# EAGLE board AMS Segment rev18 (EAGLE 9.6.2), part 1 of 2
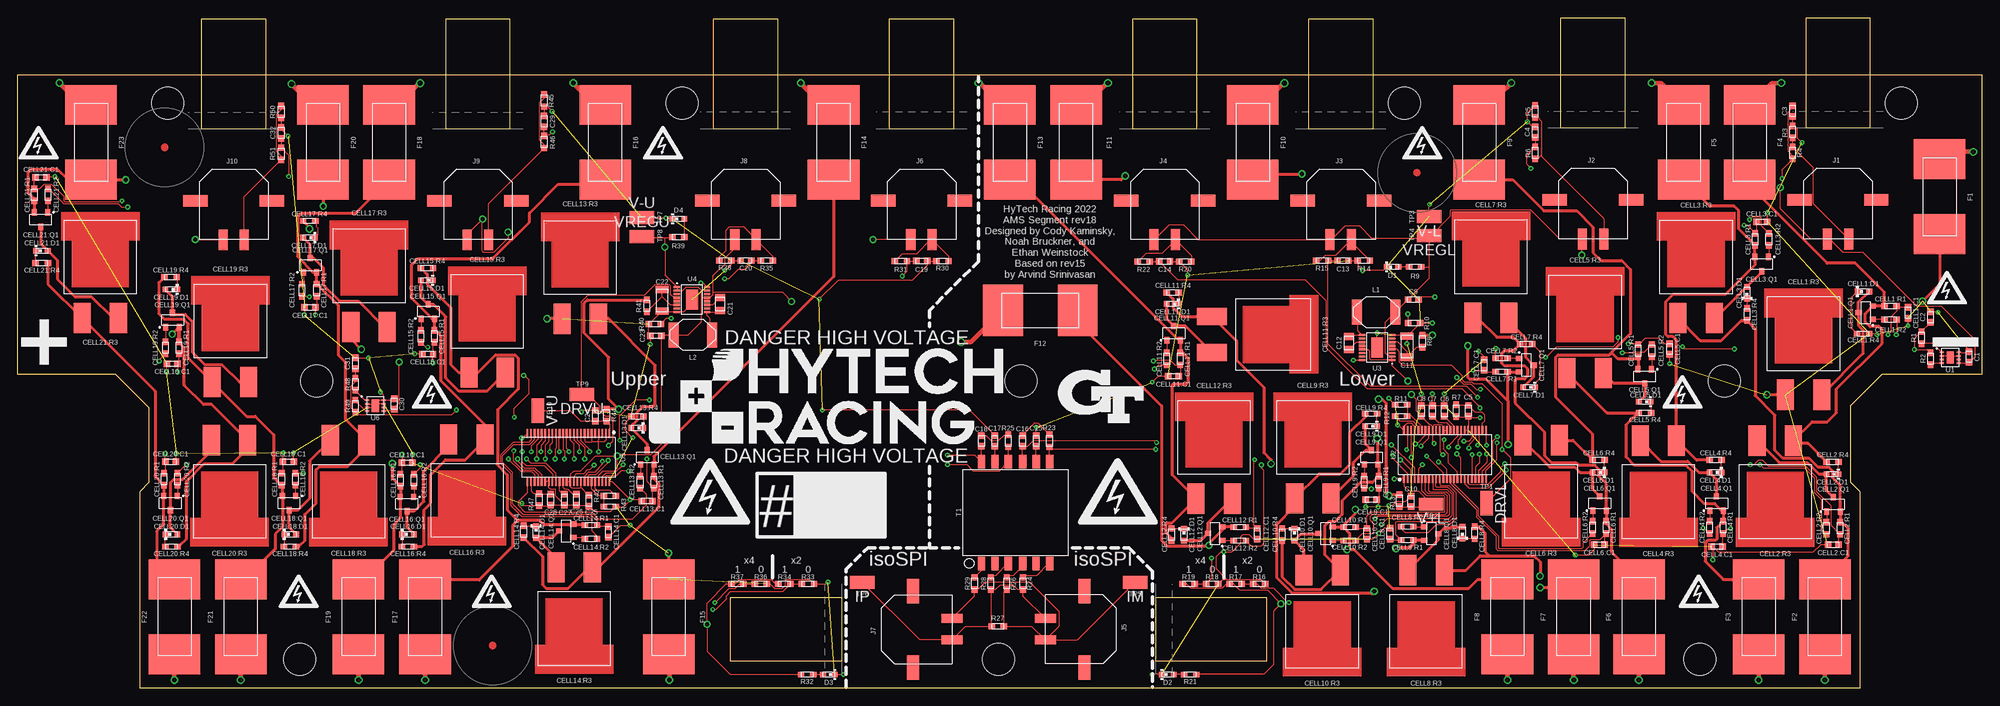
[diagram p3: board, top side]
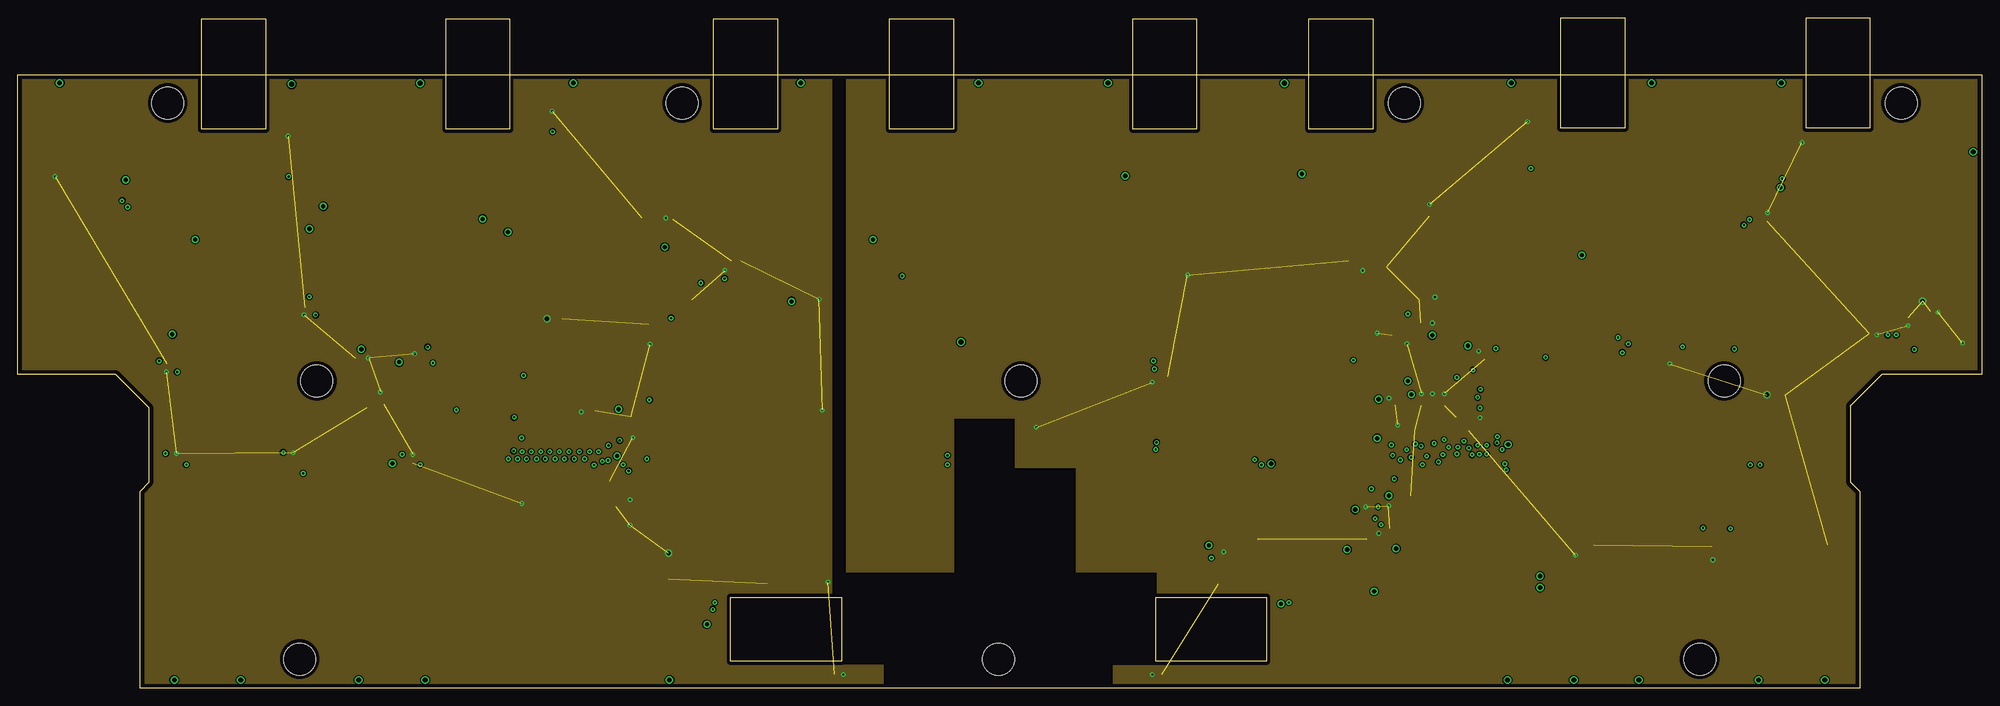
[diagram p4: board, inner layer Route2]
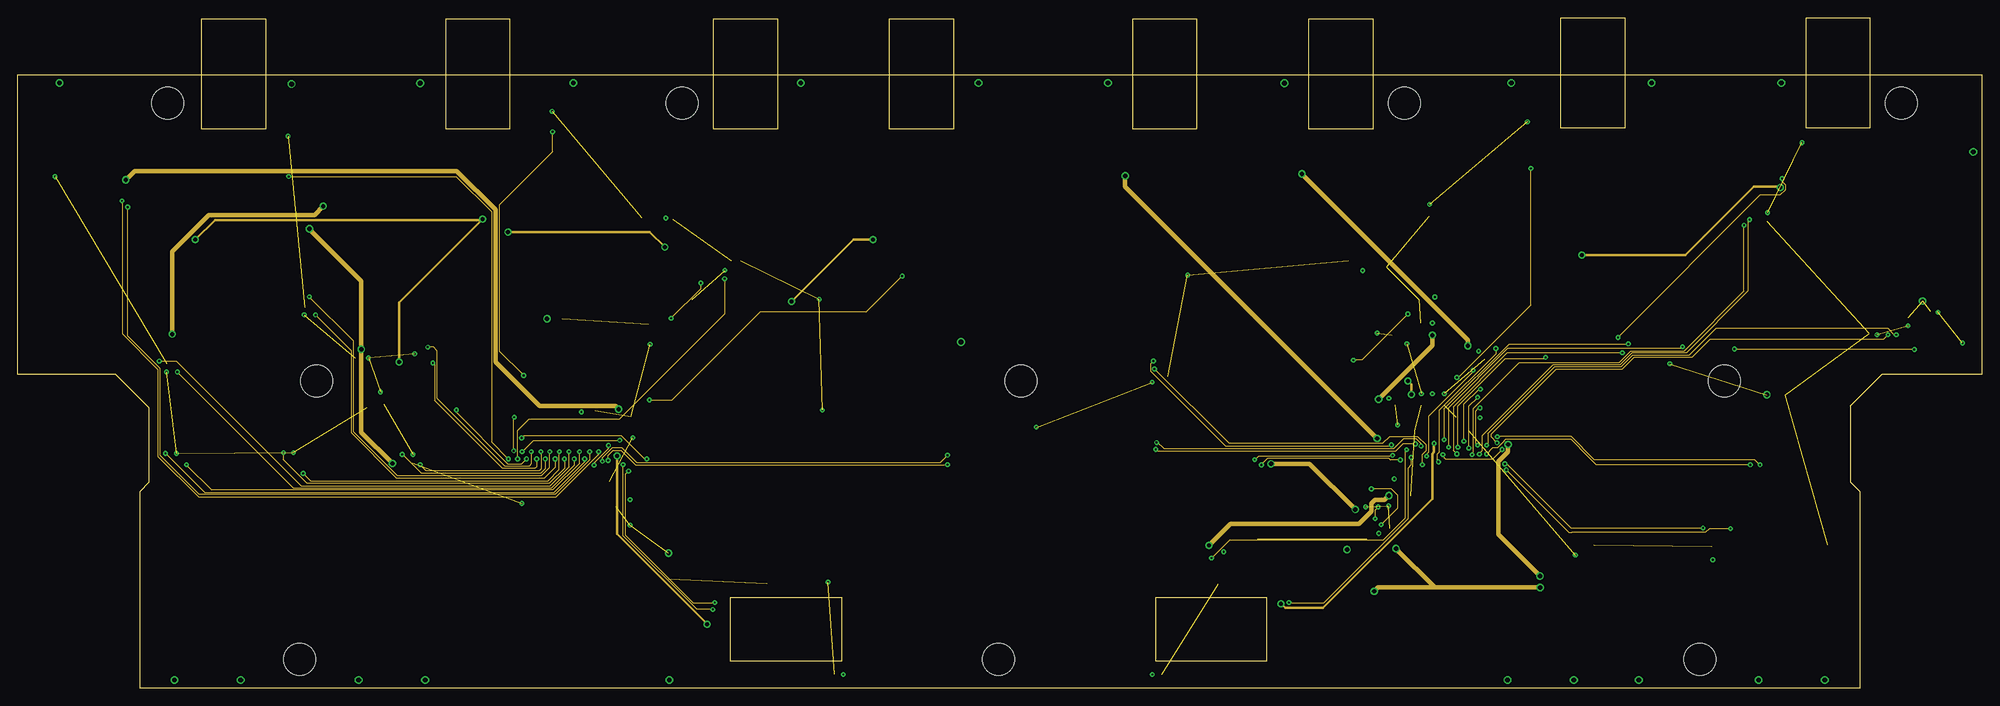
[diagram p5: board, inner layer Route15]
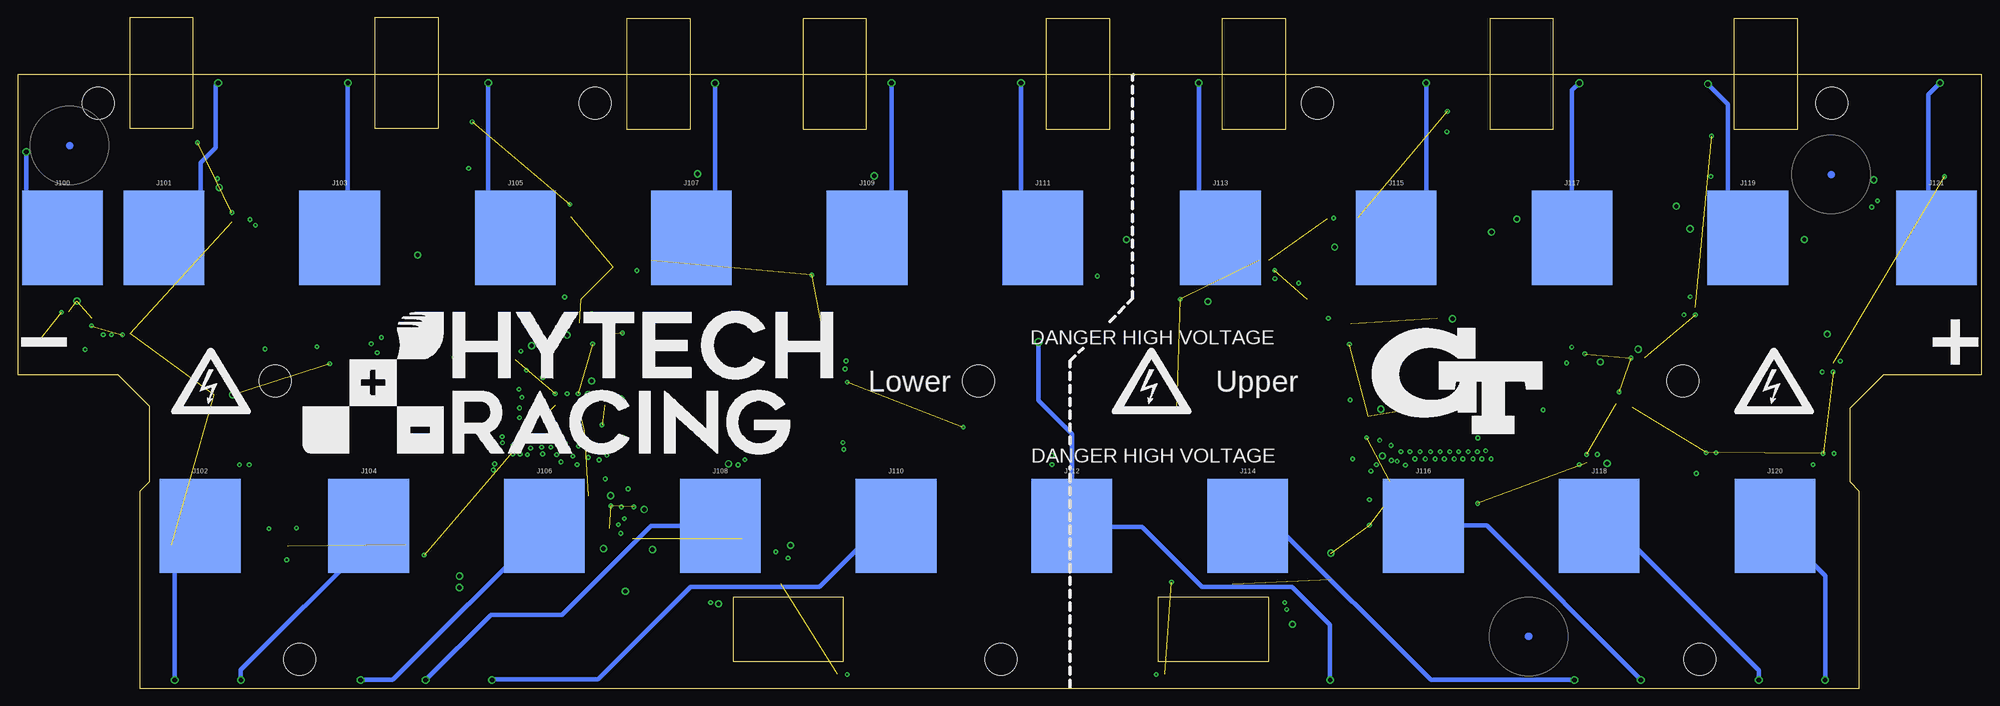
[diagram p6: board, bottom side, seen from below]

Size 275.23 x 85.98 mm. Coordinates in mm from the lower left corner, seen from the top.
Outline: 17.14,0 17.14,27.58 18.44,28.88 18.44,39.27 13.74,43.99 0,43.99 0,85.98 275.23,85.98 275.23,43.99 261.26,43.99 256.84,39.52 256.84,28.88 258.14,27.58 258.14,0 17.14,0
Copper layers (1+2*15+16): Top 0.0178mm / dielectric 12mil / Route2 0.0356mm / dielectric 28mil / Route15 0.0356mm / dielectric 12mil / Bottom 0.0178mm
Design rules "Sunstone Circuits (4 Layer)": minimum track width 6mil, minimum drill 8mil, track to track 6mil, track to pad 6mil, pad to pad 6mil, via to via 6mil, smd to smd 6mil, copper to edge 20mil, drill to drill 16mil, minimum pad ring 8mil, minimum via ring 8mil, stop-mask expansion 3mil, vias tented up to drill 30mil, thermal gap 10mil
Net classes: 1 Upper_Unfused: width 0.61 mm, drill 0.686 mm, clearance 1.6 mm to class 0, clearance 1.6 mm; 2 Lower_Unfused: width 0.61 mm, drill 0.686 mm, clearance 1.6 mm to class 0, clearance 1.6 mm to class 1, clearance 1.6 mm; 3 Upper Power: clearance 1.6 mm to class 1, clearance 1.6 mm to class 2; 4 Lower Power: clearance 1.6 mm to class 1, clearance 1.6 mm to class 2, clearance 1.6 mm to class 3; 5 IsoSPI: clearance 1.6 mm to class 1, clearance 1.6 mm to class 2, clearance 1.6 mm to class 3, clearance 1.6 mm to class 4

## Footprints (pad centres in the part's own frame; a part is rotated, then mirrored left to right if it is on the bottom)
0603-CAP = smd 0.9 x 0.9: 1 -0.75,0; 2 0.75,0
1206-CAP = smd 1 x 1.8: 1 -1.5,0; 2 1.5,0
0805-CAP = smd 0.95 x 1.4: 1 -0.925,0; 2 0.925,0
0603-LED = smd 0.8 x 0.8: 1 -0.825,0; 2 0.825,0
SOT-23 = smd 0.711 x 0.889: 1 -0.94,-1.003; 2 0.94,-1.003; 3 0,1.003
0603-RES = smd 0.9 x 0.8: 1 -0.85,0; 2 0.85,0
PWR263 = smd 2.4 x 4.23: 1 -2.54,0; 2 2.54,0
0885 = smd 5.6 x 7.23: 1 -5.25,0; 2 5.25,0
MOLEX_MICROFIT_SMD_RIGHTANGLE_02_SINGLE = smd 1.27 x 2.921: 1 1.499,5.474; 2 -1.499,5.474 | smd 3.429 x 1.651: PAD1 5.372,0; PAD2 -5.372,0
5222 = smd 11.303 x 13.208: 1 0,0
74451133 = smd 1.4 x 3.5: 1 -2.7,0; 2 2.7,0
HM2112ZNLT = smd 1.02 x 1.89: 1 -4.78,-7.145; 2 -2.89,-7.145; 3 -1,-7.145; 4 1,-7.145; 5 2.875,-7.145; 6 4.78,-7.145; 7 4.78,7.145; 8 2.89,7.145; 9 1,7.145; 10 -1,7.145; 11 -2.89,7.145; 12 -4.78,7.145
5015 = smd 3.429 x 1.778: 1 0,0
DFN-8 = smd 0.55 x 0.25: 1 -1.175,0.75; 2 -1.175,0.25; 3 -1.175,-0.25; 4 -1.175,-0.75; 5 1.175,-0.75; 6 1.175,-0.25; 7 1.175,0.25; 8 1.175,0.75 | smd 1 x 1.7: PAD 0,0
SSOP-48 = smd 0.25 x 1.25: 1 -5.75,-3.37; 2 -5.25,-3.37; 3 -4.75,-3.37; 4 -4.25,-3.37; 5 -3.75,-3.37; 6 -3.25,-3.37; 7 -2.75,-3.37; 8 -2.25,-3.37; 9 -1.75,-3.37; 10 -1.25,-3.37; 11 -0.75,-3.37; 12 -0.25,-3.37; 13 0.25,-3.37; 14 0.75,-3.37; 15 1.25,-3.37; 16 1.75,-3.37; 17 2.25,-3.37; 18 2.75,-3.37; 19 3.25,-3.37; 20 3.75,-3.37; 21 4.25,-3.37; 22 4.75,-3.37; 23 5.25,-3.37; 24 5.75,-3.37; 25 5.75,3.38; 26 5.25,3.38; 27 4.75,3.38; 28 4.25,3.38; 29 3.75,3.38; 30 3.25,3.38; 31 2.75,3.38; 32 2.25,3.38; 33 1.75,3.38; 34 1.25,3.38; 35 0.75,3.38; 36 0.25,3.38; 37 -0.25,3.38; 38 -0.75,3.38; 39 -1.25,3.38; 40 -1.75,3.38; 41 -2.25,3.38; 42 -2.75,3.38; 43 -3.25,3.38; 44 -3.75,3.38; 45 -4.25,3.38; 46 -4.75,3.38; 47 -5.25,3.38; 48 -5.75,3.38
MSE16 = smd 0.305 x 0.889: 1 -1.75,-2.106; 2 -1.25,-2.106; 3 -0.75,-2.106; 4 -0.25,-2.106; 5 0.25,-2.106; 6 0.75,-2.106; 7 1.25,-2.106; 8 1.75,-2.106; 9 1.75,2.106; 10 1.25,2.106; 11 0.75,2.106; 12 0.25,2.106; 13 -0.25,2.106; 14 -0.75,2.106; 15 -1.25,2.106; 16 -1.75,2.106 | smd 2.845 x 1.651: 17 0,0
MOUNTING_M4 = hole 4.5: 0,0

## Placement (x,y rotation side)
C1  CAPACITOR_0603_10V_0.1UF  [0603-CAP]  273.46,46.43 270 top
C2  CAPACITOR_0603_10V_3.3NF  [0603-CAP]  268.07,52.02 90 top
C3  CAPACITOR_0603_100V_10NF  [0603-CAP]  248.72,80.9 90 top
C4  CAPACITOR_0603_100V_10NF  [0603-CAP]  212.66,77.95 90 top
C5  CAPACITOR_0603_100V_10NF  [0603-CAP]  203.3,38.87 270 top
C6  CAPACITOR_0603_10V_1UF  [0603-CAP]  199.92,38.85 90 top
C7  CAPACITOR_0603_10V_1UF  [0603-CAP]  198.26,38.85 90 top
C8  CAPACITOR_0603_10V_1UF  [0603-CAP]  196.7,38.86 90 top
C9  CAPACITOR_0603_10V_22UF  [0603-CAP]  195.58,54.48 0 top
C10  CAPACITOR_0603_100V_0.1UF  [0603-CAP]  195.25,26.19 90 top
C11  CAPACITOR_1206_100V_2.2UF  [1206-CAP]  194.69,47.88 90 top
C12  CAPACITOR_0805_100V_0.22UF  [0805-CAP]  186.56,48.39 90 top
C13  CAPACITOR_0603_100V_10NF  [0603-CAP]  185.74,59.94 0 top
C14  CAPACITOR_0603_100V_10NF  [0603-CAP]  160.72,59.82 0 top
C15  CAPACITOR_0603_10V_10NF  [0603-CAP]  142.72,34.66 270 top
C16  CAPACITOR_0603_10V_15PF  [0603-CAP]  140.82,34.66 270 top
C17  CAPACITOR_0603_10V_10NF  [0603-CAP]  136.93,34.66 270 top
C18  CAPACITOR_0603_10V_15PF  [0603-CAP]  135.05,34.66 270 top
C19  CAPACITOR_0603_100V_10NF  [0603-CAP]  126.68,59.88 0 top
C20  CAPACITOR_0603_100V_10NF  [0603-CAP]  102.04,59.94 180 top
C21  CAPACITOR_0805_100V_0.22UF  [0805-CAP]  98.42,53.85 270 top
C22  CAPACITOR_1206_100V_2.2UF  [1206-CAP]  90.3,54.36 270 top
C23  CAPACITOR_0603_10V_1UF  [0603-CAP]  89.41,49.4 180 top
C24  CAPACITOR_0603_100V_0.1UF  [0603-CAP]  80.92,38.18 90 top
C25  CAPACITOR_0603_10V_22UF  [0603-CAP]  80.01,26.29 270 top
C26  CAPACITOR_0603_10V_1UF  [0603-CAP]  78.3,26.42 270 top
C27  CAPACITOR_0603_10V_1UF  [0603-CAP]  76.61,26.42 270 top
C28  CAPACITOR_0603_100V_10NF  [0603-CAP]  74.67,26.42 270 top
C29  CAPACITOR_0603_100V_10NF  [0603-CAP]  73.75,79.46 90 top
C30  CAPACITOR_0603_10V_0.1UF  [0603-CAP]  52.76,39.85 90 top
C31  CAPACITOR_0603_10V_3.3NF  [0603-CAP]  47.31,45.54 90 top
C32  CAPACITOR_0603_100V_10NF  [0603-CAP]  36.91,77.85 270 top
CELL1:C1  CAPACITOR_0603_100V_10NF  [0603-CAP]  264.9,52.63 270 top
CELL1:D1  LED_0603_RED  [0603-LED]  258.65,55.6 0 top
CELL1:Q1  TRANSISTOR_P_MOS_SOT-23_SI2369DS-T1-GE3  [SOT-23]  258.98,52.65 90 top
CELL1:R1  RESISTOR_0603_100  [0603-RES]  262.46,53.57 0 top
CELL1:R2  RESISTOR_0603_1K  [0603-RES]  262.46,51.66 0 top
CELL1:R3  RESISTOR_PWR263_7.5  [PWR263]  250.27,41.12 0 top
CELL1:R4  RESISTOR_0603_1K  [0603-RES]  258.62,49.68 180 top
CELL2:C1  CAPACITOR_0603_100V_10NF  [0603-CAP]  254.43,20.09 180 top
CELL2:D1  LED_0603_RED  [0603-LED]  254.3,30 180 top
CELL2:Q1  TRANSISTOR_P_MOS_SOT-23_SI2369DS-T1-GE3  [SOT-23]  254.46,25.76 0 top
CELL2:R1  RESISTOR_0603_100  [0603-RES]  255.37,22.4 270 top
CELL2:R2  RESISTOR_0603_1K  [0603-RES]  253.47,22.4 270 top
CELL2:R3  RESISTOR_PWR263_7.5  [PWR263]  246.3,34.7 180 top
CELL2:R4  RESISTOR_0603_1K  [0603-RES]  254.33,31.72 0 top
CELL3:C1  CAPACITOR_0603_100V_10NF  [0603-CAP]  244.42,65.38 0 top
CELL3:D1  LED_0603_RED  [0603-LED]  242.34,55.45 90 top
CELL3:Q1  TRANSISTOR_P_MOS_SOT-23_SI2369DS-T1-GE3  [SOT-23]  244.4,59.46 180 top
CELL3:R1  RESISTOR_0603_100  [0603-RES]  243.48,62.94 90 top
CELL3:R2  RESISTOR_0603_1K  [0603-RES]  245.39,62.94 90 top
CELL3:R3  RESISTOR_PWR263_7.5  [PWR263]  235.2,51.87 0 top
CELL3:R4  RESISTOR_0603_1K  [0603-RES]  242.34,52.4 90 top
CELL4:C1  CAPACITOR_0603_100V_10NF  [0603-CAP]  238.15,19.84 180 top
CELL4:D1  LED_0603_RED  [0603-LED]  237.92,30.25 180 top
CELL4:Q1  TRANSISTOR_P_MOS_SOT-23_SI2369DS-T1-GE3  [SOT-23]  238.07,25.88 0 top
CELL4:R1  RESISTOR_0603_100  [0603-RES]  238.99,22.53 270 top
CELL4:R2  RESISTOR_0603_1K  [0603-RES]  237.08,22.53 270 top
CELL4:R3  RESISTOR_PWR263_7.5  [PWR263]  229.92,34.7 180 top
CELL4:R4  RESISTOR_0603_1K  [0603-RES]  237.95,31.98 0 top
CELL5:C1  CAPACITOR_0603_100V_10NF  [0603-CAP]  231.5,47.55 270 top
CELL5:D1  LED_0603_RED  [0603-LED]  228.02,40.16 180 top
CELL5:Q1  TRANSISTOR_P_MOS_SOT-23_SI2369DS-T1-GE3  [SOT-23]  228.02,43.71 180 top
CELL5:R1  RESISTOR_0603_100  [0603-RES]  227.1,47.32 90 top
CELL5:R2  RESISTOR_0603_1K  [0603-RES]  229.01,47.32 90 top
CELL5:R3  RESISTOR_PWR263_7.5  [PWR263]  219.66,44.17 0 top
CELL5:R4  RESISTOR_0603_1K  [0603-RES]  228.04,38.58 0 top
CELL6:C1  CAPACITOR_0603_100V_10NF  [0603-CAP]  221.67,20.09 180 top
CELL6:D1  LED_0603_RED  [0603-LED]  221.54,30.25 180 top
CELL6:Q1  TRANSISTOR_P_MOS_SOT-23_SI2369DS-T1-GE3  [SOT-23]  221.69,25.88 0 top
CELL6:R1  RESISTOR_0603_100  [0603-RES]  222.61,22.53 270 top
CELL6:R2  RESISTOR_0603_1K  [0603-RES]  220.7,22.53 270 top
CELL6:R3  RESISTOR_PWR263_7.5  [PWR263]  213.49,34.75 180 top
CELL6:R4  RESISTOR_0603_1K  [0603-RES]  221.56,31.98 0 top
CELL7:C1  CAPACITOR_0603_100V_10NF  [0603-CAP]  205.51,45.29 90 top
CELL7:D1  LED_0603_RED  [0603-LED]  211.81,42.19 180 top
CELL7:Q1  TRANSISTOR_P_MOS_SOT-23_SI2369DS-T1-GE3  [SOT-23]  211.43,45.26 270 top
CELL7:R1  RESISTOR_0603_100  [0603-RES]  207.95,44.35 180 top
CELL7:R2  RESISTOR_0603_1K  [0603-RES]  207.95,46.25 180 top
CELL7:R3  RESISTOR_PWR263_7.5  [PWR263]  206.45,51.92 0 top
CELL7:R4  RESISTOR_0603_1K  [0603-RES]  211.4,48.23 0 top
CELL8:C1  CAPACITOR_0603_100V_10NF  [0603-CAP]  192.3,21.67 90 top
CELL8:D1  LED_0603_RED  [0603-LED]  202.46,21.79 90 top
CELL8:Q1  TRANSISTOR_P_MOS_SOT-23_SI2369DS-T1-GE3  [SOT-23]  198.09,21.64 270 top
CELL8:R1  RESISTOR_0603_100  [0603-RES]  194.74,20.73 180 top
CELL8:R2  RESISTOR_0603_1K  [0603-RES]  194.74,22.63 180 top
CELL8:R3  RESISTOR_PWR263_7.5  [PWR263]  197.37,16.54 180 top
CELL8:R4  RESISTOR_0603_1K  [0603-RES]  204.19,21.77 270 top
CELL9:C1  CAPACITOR_0603_100V_10NF  [0603-CAP]  189.66,26.44 180 top
CELL9:D1  LED_0603_RED  [0603-LED]  189.66,36.73 180 top
CELL9:Q1  TRANSISTOR_P_MOS_SOT-23_SI2369DS-T1-GE3  [SOT-23]  189.69,32.36 0 top
CELL9:R1  RESISTOR_0603_100  [0603-RES]  190.73,28.88 270 top
CELL9:R2  RESISTOR_0603_1K  [0603-RES]  188.7,28.88 270 top
CELL9:R3  RESISTOR_PWR263_7.5  [PWR263]  181.48,26.59 0 top
CELL9:R4  RESISTOR_0603_1K  [0603-RES]  189.69,38.46 0 top
CELL10:C1  CAPACITOR_0603_100V_10NF  [0603-CAP]  189.08,21.64 270 top
CELL10:D1  LED_0603_RED  [0603-LED]  178.92,21.51 270 top
CELL10:Q1  TRANSISTOR_P_MOS_SOT-23_SI2369DS-T1-GE3  [SOT-23]  183.29,21.67 90 top
CELL10:R1  RESISTOR_0603_100  [0603-RES]  186.64,22.58 0 top
CELL10:R2  RESISTOR_0603_1K  [0603-RES]  186.64,20.68 0 top
CELL10:R3  RESISTOR_PWR263_7.5  [PWR263]  182.8,16.54 180 top
CELL10:R4  RESISTOR_0603_1K  [0603-RES]  177.19,21.54 90 top
CELL11:C1  CAPACITOR_0603_100V_10NF  [0603-CAP]  161.98,43.71 180 top
CELL11:D1  LED_0603_RED  [0603-LED]  161.85,53.87 180 top
CELL11:Q1  TRANSISTOR_P_MOS_SOT-23_SI2369DS-T1-GE3  [SOT-23]  162,49.76 0 top
CELL11:R1  RESISTOR_0603_100  [0603-RES]  162.92,46.15 270 top
CELL11:R2  RESISTOR_0603_1K  [0603-RES]  161.01,46.15 270 top
CELL11:R3  RESISTOR_PWR263_7.5  [PWR263]  167.36,49.58 270 top
CELL11:R4  RESISTOR_0603_1K  [0603-RES]  161.87,55.47 0 top
CELL12:C1  CAPACITOR_0603_100V_10NF  [0603-CAP]  173.71,21.64 270 top
CELL12:D1  LED_0603_RED  [0603-LED]  163.42,21.51 270 top
CELL12:Q1  TRANSISTOR_P_MOS_SOT-23_SI2369DS-T1-GE3  [SOT-23]  167.79,21.67 90 top
CELL12:R1  RESISTOR_0603_100  [0603-RES]  171.27,22.58 0 top
CELL12:R2  RESISTOR_0603_1K  [0603-RES]  171.27,20.68 0 top
CELL12:R3  RESISTOR_PWR263_7.5  [PWR263]  167.67,26.57 0 top
CELL12:R4  RESISTOR_0603_1K  [0603-RES]  161.7,21.54 90 top
CELL13:C1  CAPACITOR_0603_100V_10NF  [0603-CAP]  88.19,26.24 180 top
CELL13:D1  LED_0603_RED  [0603-LED]  86.79,36.47 180 top
CELL13:Q1  TRANSISTOR_P_MOS_SOT-23_SI2369DS-T1-GE3  [SOT-23]  88.21,32.36 0 top
CELL13:R1  RESISTOR_0603_100  [0603-RES]  89.13,28.88 270 top
CELL13:R2  RESISTOR_0603_1K  [0603-RES]  87.22,28.88 270 top
CELL13:R3  RESISTOR_PWR263_7.5  [PWR263]  78.82,51.79 0 top
CELL13:R4  RESISTOR_0603_1K  [0603-RES]  86.82,38.07 0 top
CELL14:C1  CAPACITOR_0603_100V_10NF  [0603-CAP]  82.78,21.89 270 top
CELL14:D1  LED_0603_RED  [0603-LED]  72.62,21.89 270 top
CELL14:Q1  TRANSISTOR_P_MOS_SOT-23_SI2369DS-T1-GE3  [SOT-23]  76.86,22.05 90 top
CELL14:R1  RESISTOR_0603_100  [0603-RES]  80.34,22.83 0 top
CELL14:R2  RESISTOR_0603_1K  [0603-RES]  80.34,20.93 0 top
CELL14:R3  RESISTOR_PWR263_7.5  [PWR263]  77.98,16.92 180 top
CELL14:R4  RESISTOR_0603_1K  [0603-RES]  70.89,21.92 90 top
CELL15:C1  CAPACITOR_0603_100V_10NF  [0603-CAP]  57.45,46.84 180 top
CELL15:D1  LED_0603_RED  [0603-LED]  57.33,57.18 180 top
CELL15:Q1  TRANSISTOR_P_MOS_SOT-23_SI2369DS-T1-GE3  [SOT-23]  57.48,52.81 0 top
CELL15:R1  RESISTOR_0603_100  [0603-RES]  58.39,49.33 270 top
CELL15:R2  RESISTOR_0603_1K  [0603-RES]  56.49,49.33 270 top
CELL15:R3  RESISTOR_PWR263_7.5  [PWR263]  65.79,44.25 0 top
CELL15:R4  RESISTOR_0603_1K  [0603-RES]  57.35,58.9 0 top
CELL16:C1  CAPACITOR_0603_100V_10NF  [0603-CAP]  54.56,31.6 0 top
CELL16:D1  LED_0603_RED  [0603-LED]  54.69,21.56 0 top
CELL16:Q1  TRANSISTOR_P_MOS_SOT-23_SI2369DS-T1-GE3  [SOT-23]  54.53,25.81 180 top
CELL16:R1  RESISTOR_0603_100  [0603-RES]  53.62,29.16 90 top
CELL16:R2  RESISTOR_0603_1K  [0603-RES]  55.52,29.16 90 top
CELL16:R3  RESISTOR_PWR263_7.5  [PWR263]  62.94,34.87 180 top
CELL16:R4  RESISTOR_0603_1K  [0603-RES]  54.66,19.84 180 top
CELL17:C1  CAPACITOR_0603_100V_10NF  [0603-CAP]  40.94,53.37 180 top
CELL17:D1  LED_0603_RED  [0603-LED]  40.82,63.17 180 top
CELL17:Q1  TRANSISTOR_P_MOS_SOT-23_SI2369DS-T1-GE3  [SOT-23]  40.97,59.28 0 top
CELL17:R1  RESISTOR_0603_100  [0603-RES]  41.88,55.8 270 top
CELL17:R2  RESISTOR_0603_1K  [0603-RES]  39.83,55.8 270 top
CELL17:R3  RESISTOR_PWR263_7.5  [PWR263]  49.23,50.65 0 top
CELL17:R4  RESISTOR_0603_1K  [0603-RES]  40.84,65.51 0 top
CELL18:C1  CAPACITOR_0603_100V_10NF  [0603-CAP]  37.92,31.72 0 top
CELL18:D1  LED_0603_RED  [0603-LED]  38.18,21.56 0 top
CELL18:Q1  TRANSISTOR_P_MOS_SOT-23_SI2369DS-T1-GE3  [SOT-23]  38.02,25.93 180 top
CELL18:R1  RESISTOR_0603_100  [0603-RES]  36.98,29.29 90 top
CELL18:R2  RESISTOR_0603_1K  [0603-RES]  38.89,29.29 90 top
CELL18:R3  RESISTOR_PWR263_7.5  [PWR263]  46.36,34.75 180 top
CELL18:R4  RESISTOR_0603_1K  [0603-RES]  38.15,19.84 180 top
CELL19:C1  CAPACITOR_0603_100V_10NF  [0603-CAP]  21.64,45.49 180 top
CELL19:D1  LED_0603_RED  [0603-LED]  21.51,55.91 180 top
CELL19:Q1  TRANSISTOR_P_MOS_SOT-23_SI2369DS-T1-GE3  [SOT-23]  21.67,51.61 0 top
CELL19:R1  RESISTOR_0603_100  [0603-RES]  22.58,47.73 270 top
CELL19:R2  RESISTOR_0603_1K  [0603-RES]  20.68,47.73 270 top
CELL19:R3  RESISTOR_PWR263_7.5  [PWR263]  29.79,42.9 0 top
CELL19:R4  RESISTOR_0603_1K  [0603-RES]  21.41,57.63 0 top
CELL20:C1  CAPACITOR_0603_100V_10NF  [0603-CAP]  21.41,31.72 0 top
CELL20:D1  LED_0603_RED  [0603-LED]  21.54,21.56 0 top
CELL20:Q1  TRANSISTOR_P_MOS_SOT-23_SI2369DS-T1-GE3  [SOT-23]  21.39,25.93 180 top
CELL20:R1  RESISTOR_0603_100  [0603-RES]  20.47,29.29 90 top
CELL20:R2  RESISTOR_0603_1K  [0603-RES]  22.38,29.29 90 top
CELL20:R3  RESISTOR_PWR263_7.5  [PWR263]  29.67,34.75 180 top
CELL20:R4  RESISTOR_0603_1K  [0603-RES]  21.51,19.84 180 top
CELL21:C1  CAPACITOR_0603_100V_10NF  [0603-CAP]  3.25,71.6 0 top
CELL21:D1  LED_0603_RED  [0603-LED]  3.38,61.32 0 top
CELL21:Q1  TRANSISTOR_P_MOS_SOT-23_SI2369DS-T1-GE3  [SOT-23]  3.23,65.68 180 top
CELL21:R1  RESISTOR_0603_100  [0603-RES]  2.31,69.16 90 top
CELL21:R2  RESISTOR_0603_1K  [0603-RES]  4.22,69.16 90 top
CELL21:R3  RESISTOR_PWR263_7.5  [PWR263]  11.56,51.87 0 top
CELL21:R4  RESISTOR_0603_1K  [0603-RES]  3.35,59.59 180 top
D1  LED_0603_BLUE  [0603-LED]  192.66,59.05 0 top
D2  LED_0603_BLUE  [0603-LED]  161.16,1.91 0 top
D3  LED_0603_BLUE  [0603-LED]  113.66,1.91 180 top
D4  LED_0603_BLUE  [0603-LED]  92.58,65.79 0 top
F1  FUSE_0885_1  [0885]  269.34,68.9 270 top
F2  FUSE_0885_1  [0885]  253.26,9.99 90 top
F3  FUSE_0885_1  [0885]  243.98,9.99 90 top
F4  FUSE_0885_1  [0885]  242.72,76.52 270 top
F5  FUSE_0885_1  [0885]  233.45,76.52 270 top
F6  FUSE_0885_1  [0885]  227.2,9.99 90 top
F7  FUSE_0885_1  [0885]  218.04,9.99 90 top
F8  FUSE_0885_1  [0885]  208.76,9.99 90 top
F9  FUSE_0885_1  [0885]  204.83,76.52 270 top
F10  FUSE_0885_1  [0885]  173.08,76.52 270 top
F11  FUSE_0885_1  [0885]  148.31,76.52 270 top
F12  FUSE_0885_1  [0885]  143.29,52.96 0 top
F13  FUSE_0885_1  [0885]  139.04,76.52 270 top
F14  FUSE_0885_1  [0885]  114.33,76.52 270 top
F15  FUSE_0885_1  [0885]  91.21,9.99 90 top
F16  FUSE_0885_1  [0885]  82.32,76.52 270 top
F17  FUSE_0885_1  [0885]  57.09,9.99 90 top
F18  FUSE_0885_1  [0885]  52.04,76.52 270 top
F19  FUSE_0885_1  [0885]  47.75,9.99 90 top
F20  FUSE_0885_1  [0885]  42.77,76.52 270 top
F21  FUSE_0885_1  [0885]  31.24,9.99 90 top
F22  FUSE_0885_1  [0885]  21.97,9.99 90 top
F23  FUSE_0885_1  [0885]  10.26,76.52 270 top
J1  CONNECTOR-2_MICROFIT_SMD_RIGHTANGLE_02_SINGLE_BLACK  [MOLEX_MICROFIT_SMD_RIGHTANGLE_02_SINGLE]  255.09,68.45 180 top
J2  CONNECTOR-2_MICROFIT_SMD_RIGHTANGLE_02_SINGLE_BLACK  [MOLEX_MICROFIT_SMD_RIGHTANGLE_02_SINGLE]  220.76,68.45 180 top
J3  CONNECTOR-2_MICROFIT_SMD_RIGHTANGLE_02_SINGLE_BLACK  [MOLEX_MICROFIT_SMD_RIGHTANGLE_02_SINGLE]  185.42,68.36 180 top
J4  CONNECTOR-2_MICROFIT_SMD_RIGHTANGLE_02_SINGLE_BLACK  [MOLEX_MICROFIT_SMD_RIGHTANGLE_02_SINGLE]  160.73,68.36 180 top
J5  CONNECTOR-2_MICROFIT_SMD_RIGHTANGLE_02_SINGLE_BLACK  [MOLEX_MICROFIT_SMD_RIGHTANGLE_02_SINGLE]  149.48,8.25 90 top
J6  CONNECTOR-2_MICROFIT_SMD_RIGHTANGLE_02_SINGLE_BLACK  [MOLEX_MICROFIT_SMD_RIGHTANGLE_02_SINGLE]  126.64,68.36 180 top
J7  CONNECTOR-2_MICROFIT_SMD_RIGHTANGLE_02_SINGLE_BLACK  [MOLEX_MICROFIT_SMD_RIGHTANGLE_02_SINGLE]  125.45,8.25 270 top
J8  CONNECTOR-2_MICROFIT_SMD_RIGHTANGLE_02_SINGLE_BLACK  [MOLEX_MICROFIT_SMD_RIGHTANGLE_02_SINGLE]  101.98,68.36 180 top
J9  CONNECTOR-2_MICROFIT_SMD_RIGHTANGLE_02_SINGLE_BLACK  [MOLEX_MICROFIT_SMD_RIGHTANGLE_02_SINGLE]  64.48,68.33 180 top
J10  CONNECTOR-2_MICROFIT_SMD_RIGHTANGLE_02_SINGLE_BLACK  [MOLEX_MICROFIT_SMD_RIGHTANGLE_02_SINGLE]  30.25,68.33 180 top
J100  CONNECTOR-1_5222  [5222]  268.99,63.12 0 bottom
J101  CONNECTOR-1_5222  [5222]  254.76,63.12 0 bottom
J102  CONNECTOR-1_5222  [5222]  249.68,22.73 0 bottom
J103  CONNECTOR-1_5222  [5222]  230.12,63.12 0 bottom
J104  CONNECTOR-1_5222  [5222]  226.06,22.73 0 bottom
J105  CONNECTOR-1_5222  [5222]  205.49,63.12 0 bottom
J106  CONNECTOR-1_5222  [5222]  201.42,22.73 0 bottom
J107  CONNECTOR-1_5222  [5222]  180.85,63.12 0 bottom
J108  CONNECTOR-1_5222  [5222]  176.78,22.73 0 bottom
J109  CONNECTOR-1_5222  [5222]  156.21,63.12 0 bottom
J110  CONNECTOR-1_5222  [5222]  152.15,22.73 0 bottom
J111  CONNECTOR-1_5222  [5222]  131.57,63.12 0 bottom
J112  CONNECTOR-1_5222  [5222]  127.51,22.73 0 bottom
J113  CONNECTOR-1_5222  [5222]  106.68,63.12 0 bottom
J114  CONNECTOR-1_5222  [5222]  102.87,22.73 0 bottom
J115  CONNECTOR-1_5222  [5222]  82.04,63.12 0 bottom
J116  CONNECTOR-1_5222  [5222]  78.23,22.73 0 bottom
J117  CONNECTOR-1_5222  [5222]  57.4,63.12 0 bottom
J118  CONNECTOR-1_5222  [5222]  53.59,22.73 0 bottom
J119  CONNECTOR-1_5222  [5222]  32.77,63.12 0 bottom
J120  CONNECTOR-1_5222  [5222]  28.96,22.73 0 bottom
J121  CONNECTOR-1_5222  [5222]  6.35,63.12 0 bottom
L1  INDUCTOR_74451133_33UH  [74451133]  190.37,52.7 0 top
L2  INDUCTOR_74451133_33UH  [74451133]  94.61,49.53 180 top
R1  RESISTOR_0603_100  [0603-RES]  266.8,49.15 270 top
R2  RESISTOR_0603_DNP  [0603-RES]  268.07,46.19 270 top
R3  RESISTOR_0603_2.74K  [0603-RES]  248.72,77.98 270 top
R4  RESISTOR_0603_100  [0603-RES]  248.72,75.06 270 top
R5  RESISTOR_0603_2.74K  [0603-RES]  212.66,80.87 90 top
R6  RESISTOR_0603_100  [0603-RES]  212.66,75.03 90 top
R7  RESISTOR_0603_100  [0603-RES]  201.57,38.87 90 top
R8  RESISTOR_0603_470  [0603-RES]  196.85,48.64 270 top
R9  RESISTOR_0603_1K  [0603-RES]  195.83,59.05 0 top
R10  RESISTOR_0603_374K  [0603-RES]  195.71,51.18 180 top
R11  RESISTOR_0603_1K  [0603-RES]  193.87,39.73 0 top
R12  RESISTOR_0603_1K  [0603-RES]  193.87,38.13 180 top
R13  RESISTOR_0603_100  [0603-RES]  193.62,26.29 90 top
R14  RESISTOR_0603_2.74K  [0603-RES]  188.65,59.94 180 top
R15  RESISTOR_0603_100  [0603-RES]  182.83,59.94 0 top
R16  JUMPER_0603_  [0603-RES]  173.99,14.61 0 top
R17  JUMPER_0603_  [0603-RES]  170.69,14.61 0 top
R18  JUMPER_0603_  [0603-RES]  167.39,14.61 0 top
R19  JUMPER_0603_  [0603-RES]  164.08,14.61 0 top
R20  RESISTOR_0603_2.74K  [0603-RES]  163.63,59.82 180 top
R21  RESISTOR_0603_1K  [0603-RES]  164.34,1.91 0 top
R22  RESISTOR_0603_100  [0603-RES]  157.81,59.82 0 top
R23  RESISTOR_0603_402  [0603-RES]  144.6,34.66 270 top
R24  RESISTOR_0603_22  [0603-RES]  140.87,14.68 90 top
R25  RESISTOR_0603_402  [0603-RES]  138.81,34.66 270 top
R26  RESISTOR_0603_22  [0603-RES]  138.61,14.68 90 top
R27  RESISTOR_0603_DNP  [0603-RES]  137.34,8.66 180 top
R28  RESISTOR_0603_22  [0603-RES]  136.35,14.68 90 top
R29  RESISTOR_0603_22  [0603-RES]  134.09,14.68 90 top
R30  RESISTOR_0603_2.74K  [0603-RES]  129.59,59.88 180 top
R31  RESISTOR_0603_100  [0603-RES]  123.77,59.88 0 top
R32  RESISTOR_0603_1K  [0603-RES]  110.62,1.91 180 top
R33  JUMPER_0603_  [0603-RES]  110.74,14.61 0 top
R34  JUMPER_0603_  [0603-RES]  107.44,14.61 0 top
R35  RESISTOR_0603_100  [0603-RES]  104.95,59.94 180 top
R36  JUMPER_0603_  [0603-RES]  104.14,14.61 0 top
R37  JUMPER_0603_  [0603-RES]  100.84,14.61 0 top
R38  RESISTOR_0603_2.74K  [0603-RES]  99.14,59.94 0 top
R39  RESISTOR_0603_1K  [0603-RES]  92.58,63.25 180 top
R40  RESISTOR_0603_374K  [0603-RES]  89.28,51.05 0 top
R41  RESISTOR_0603_470  [0603-RES]  88.14,53.59 270 top
R42  RESISTOR_0603_1K  [0603-RES]  82.98,26.95 180 top
R43  RESISTOR_0603_1K  [0603-RES]  82.98,25.43 180 top
R44  RESISTOR_0603_100  [0603-RES]  82.52,38.28 270 top
R45  RESISTOR_0603_2.74K  [0603-RES]  73.75,82.37 270 top
R46  RESISTOR_0603_100  [0603-RES]  73.75,76.56 90 top
R47  RESISTOR_0603_100  [0603-RES]  73.05,26.42 90 top
R48  RESISTOR_0603_DNP  [0603-RES]  47.31,42.6 270 top
R49  RESISTOR_0603_100  [0603-RES]  47.31,39.55 270 top
R50  RESISTOR_0603_2.74K  [0603-RES]  36.91,80.77 270 top
R51  RESISTOR_0603_100  [0603-RES]  36.91,74.93 270 top
T1  TRANSFORMER_HM2112ZNLT  [HM2112ZNLT]  139.83,24.61 0 top
TP1  TEST_POINT  [5015]  205.84,25.96 270 top
TP2  TEST_POINT  [5015]  198.09,25.81 180 top
TP3  TEST_POINT  [5015]  197.79,66.1 180 top
TP4  TEST_POINT  [5015]  197.79,63.44 180 top
TP5  TEST_POINT  [5015]  156.59,14.83 180 top
TP6  TEST_POINT  [5015]  118.34,14.83 180 top
TP7  TEST_POINT  [5015]  87.45,65.98 0 top
TP8  TEST_POINT  [5015]  87.45,63.31 0 top
TP9  TEST_POINT  [5015]  79.04,41.17 180 top
TP10  TEST_POINT  [5015]  72.87,38.91 270 top
U1  SHT31-ARP-B  [DFN-8]  270.84,46.33 0 top
U2  LTC6811-2  [SSOP-48]  200.03,32.73 0 top
U3  LT3990-5  [MSE16]  190.5,47.75 90 top
U4  LT3990-5  [MSE16]  94.49,54.48 270 top
U5  LTC6811-2  [SSOP-48]  77.17,32.36 180 top
U6  SHT31-ARP-B  [DFN-8]  50.11,39.6 0 top
U$1  [HV_0.50"]  270.38,56.13 0 top
U$2  [MOUNTING_M4]  263.96,82.04 0 top
U$3  [MOUNTING_M4]  239.14,43.05 0 top
U$4  [MOUNTING_M4]  235.71,4.06 0 top
U$5  [HV_0.50"]  235.59,13.59 0 top
U$6  [HV_0.50"]  233.3,41.53 0 top
U$7  [HV_0.50"]  196.85,76.45 0 top
U$8  [MOUNTING_M4]  194.31,82.04 0 top
U$9  [HV_1.00"]  154.18,27.56 0 top
U$10  [LOGO_GT_MEDIUM]  151.77,40.89 0 top
U$11  [MOUNTING_M4]  140.59,43.05 0 top
U$12  [MOUNTING_M4]  137.41,4.06 0 top
U$13  [DANGER_HIGH_VOLTAGE]  116.2,49.21 0 top
U$14  [DANGER_HIGH_VOLTAGE]  116.08,32.64 0 top
U$15  [NUMBER]  103.63,21.21 0 top
U$16  [HV_1.00"]  97.03,27.56 0 top
U$17  [MOUNTING_M4]  93.09,82.04 0 top
U$18  [HV_0.50"]  90.42,76.45 0 top
U$19  [LOGO_HYTECH_LARGE]  88.39,34.29 0 top
U$20  [HV_0.50"]  66.42,13.59 0 top
U$21  [MOUNTING_M4]  41.91,43.05 0 top
U$22  [MOUNTING_M4]  39.5,4.06 0 top
U$23  [HV_0.50"]  39.37,13.59 0 top
U$24  [MOUNTING_M4]  21.01,82.04 0 top
U$25  [HV_0.50"]  2.92,76.45 0 top
U$26  [LOGO_GT_LARGE]  73.53,43.05 0 bottom
U$27  [FIDUCIAL_1MM]  21.08,72.01 0 bottom
U$28  [FIDUCIAL_1MM]  63.5,7.24 0 bottom
U$29  [FIDUCIAL_1MM]  267.97,76.07 0 bottom
U$31  [FIDUCIAL_1MM]  20.57,75.82 0 top
U$32  [FIDUCIAL_1MM]  196.09,72.26 0 top
U$33  [FIDUCIAL_1MM]  66.55,5.97 0 top
U$34  [HV_0.50"]  58.04,41.53 0 top
U$35  [LOGO_HYTECH_EXTRA_LARGE]  235.46,32.64 0 bottom
U$101  [HV_LARGE]  248.16,43.05 0 bottom
U$102  [HV_LARGE]  116.33,43.05 0 bottom
U$103  [HV_LARGE]  29.08,43.05 0 bottom